# EAGLE design second_flight_computer (EAGLE 9.6.2)
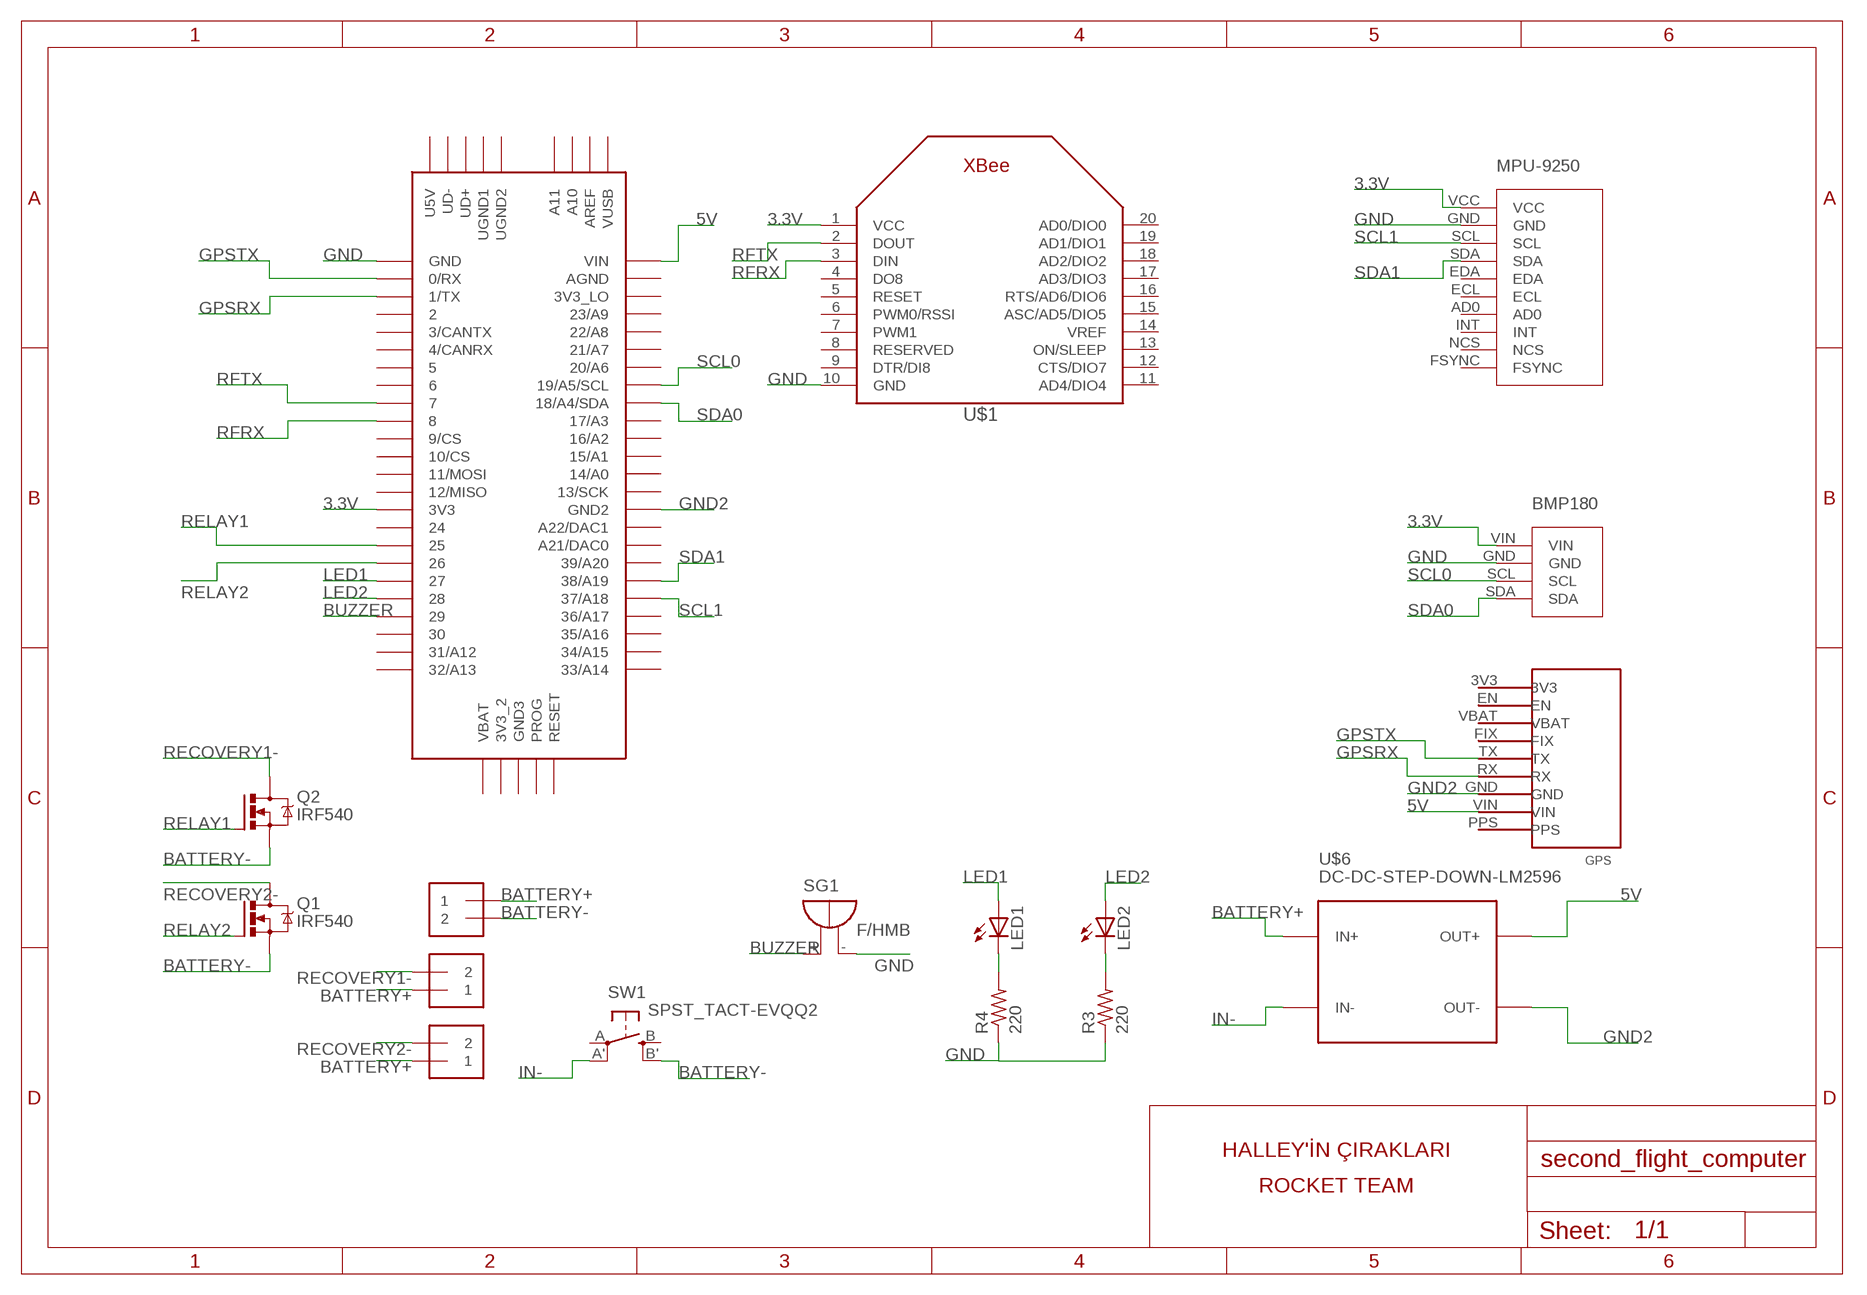
[diagram p0: schematic, sheet 1]

## Parts
BMP1  BMP180  [BMP180]
J1  1X2-3.5MM  [1X2-3.5MM]
J2  1X2-3.5MM  [1X2-3.5MM]
J3  1X2-3.5MM  [1X2-3.5MM]
LED1  LED5MM  [LED5MM]
LED2  LED5MM  [LED5MM]
MPU-1  MPU-9250  [MPU-9250]
Q1  IRF540  NMOSFET_IRF540-TO220  [TO220BV]
Q2  IRF540  NMOSFET_IRF540-TO220  [TO220BV]
R3  220  R-US_0204/7  [0204/7]
R4  220  R-US_0204/7  [0204/7]
SG1  F/HMB  [F/HMB]
SW1  SPST_TACT-EVQQ2  [EVQ-Q2]
U$1  XBEE  [XBEE]
U$3  TEENSY_3.5/3.6  [TEENSY_3.5/3.6]
U$5  GPS  [GPS]
U$6  DC-DC-STEP-DOWN-LM2596  [DC-DC-STEP-DOWN-LM2596]

## Nets
3.3V: BMP1.VIN MPU-1.VCC U$1.1(VCC) U$3.3V3
5V: U$3.VIN U$5.VIN U$6.OUT+
BATTERY+: J1.1 J2.1 J3.1 U$6.IN+
BATTERY-: J1.2 Q1.S Q2.S SW1.B'(S1)
BUZZER: SG1.+ U$3.29
GND: BMP1.GND MPU-1.GND R3.1 R4.1 SG1.- U$1.10(GND) U$3.GND
GND2: U$3.GND2 U$5.GND U$6.OUT-
GPSRX: U$3.1/TX U$5.RX
GPSTX: U$3.0/RX U$5.TX
IN-: SW1.A'(P1) U$6.IN-
LED1: LED1.A U$3.27
LED2: LED2.A U$3.28
N$1: LED1.K(C) R4.2
N$2: LED2.K(C) R3.2
RECOVERY1-: J2.2 Q2.D
RECOVERY2-: J3.2 Q1.D
RELAY1: Q2.G U$3.25
RELAY2: Q1.G U$3.26
RFRX: U$1.3(DIN) U$3.8
RFTX: U$1.2(DOUT) U$3.7
SCL0: BMP1.SCL U$3.19/A5/SCL
SCL1: MPU-1.SCL U$3.37/A18
SDA0: BMP1.SDA U$3.18/A4/SDA
SDA1: MPU-1.SDA U$3.38/A19
Unconnected: MPU-1.AD0 MPU-1.ECL MPU-1.EDA MPU-1.FSYNC MPU-1.INT MPU-1.NCS SW1.A(P) SW1.B(S) U$1.4(DO8) U$1.5(RESET) U$1.6(PWM0/RSSI) U$1.7(PWM1) U$1.8(RESERVED) U$1.9(DTR/DI8) U$1.11(AD4/DIO4) U$1.12(CTS/DIO7) U$1.13(ON/SLEEP) U$1.14(VREF) U$1.15(ASC/AD5/DIO5) U$1.16(RTS/AD6/DIO6) U$1.17(AD3/DIO3) U$1.18(AD2/DIO2) U$1.19(AD1/DIO1) U$1.20(AD0/DIO0) U$3.2 U$3.3/CANTX U$3.3V3_2 U$3.3V3_LO U$3.4/CANRX U$3.5 U$3.6 U$3.9/CS U$3.10/CS U$3.11/MOSI U$3.12/MISO U$3.13/SCK U$3.14/A0 U$3.15/A1 U$3.16/A2 U$3.17/A3 U$3.20/A6 U$3.21/A7 U$3.21/DAC0(A21/DAC0) U$3.22/A8 U$3.23/A9 U$3.24 U$3.30 U$3.31/A12 U$3.32/A13 U$3.33/A14 U$3.34/A15 U$3.35/A16 U$3.36/A17 U$3.39/A20 U$3.A10 U$3.A11 U$3.A22/DAC1 U$3.AGND U$3.AREF U$3.GND3 U$3.PROG U$3.RESET U$3.U5V U$3.UD+ U$3.UD- U$3.UGND1 U$3.UGND2 U$3.VBAT U$3.VUSB U$5.3V3 U$5.EN U$5.FIX U$5.PPS U$5.VBAT

## Notes on the sheet
- HALLEY'İN ÇIRAKLARI
- ROCKET TEAM

## Library data of the parts
BMP1 = BMP180-Lib:BMP180
J1-J3 = adafruit:1X2: 3.5mm Terminal block http://www.ladyada.net/library/pcb/eaglelibrary.html
LED1 LED2 = adafruit:LED: LED OSRAM: - CHIPLED LG R971, LG N971, LY N971, LG Q971, LY Q971, LO R971, LY R971 LH N974, LH R974 LS Q976, LO Q976, LY Q976 LO Q996 - Hyper CHIPLED LW Q18S LB Q993, LB Q99A, LB R99A - SideLED LS A670, LO A670, LY A670, LG A670, LP A670 LB A673, LV A673, LT A673, LW A673 LH A674 LY A675 LS A676, LA A676, LO A676, LY A676, LW A676 LS A679, LY A679, LG A679 - Hyper Micro SIDELED® LS Y876, LA Y876, LO Y876, LY Y876 LT Y87S - SmartLED LW L88C, LW L88S LB L89C, LB L89S, LG L890 LS L89K, LO L89K, LY L89K LS L896, LA L896, LO L896, LY L896 - TOPLED LS T670, LO T670, LY T670, LG T670, LP T670 LSG T670, LSP T670, LSY T670, LOP T670, LYG T670 LG T671, LOG T671, LSG T671 LB T673, LV T673, LT T673, LW T673 LH T674 LS T676, LA T676, LO T676, LY T676, LB T676, LH T676, LSB T676, LW T676 LB T67C, LV T67C, LT T67C, LS T67K, LO T67K, LY T67K, LW E67C LS E67B, LA E67B, LO E67B, LY E67B, LB E67C, LV E67C, LT E67C LW T67C LS T679, LY T679, LG T679 LS T770, LO T770, LY T770, LG T770, LP T770 LB T773, LV T773, LT T773, LW T773 LH T774 LS E675, LA E675, LY E675, LS T675 LS T776, LA T776, LO T776, LY T776, LB T776 LHGB T686 LT T68C, LB T68C - Hyper Mini TOPLED® LB M676 - Mini TOPLED Santana® LG M470 LS M47K, LO M47K, LY M47K Source: http://www.osram.convergy.de/
MPU-1 = MPU-9250:MPU-9250
Q1 Q2 = Transistor:NMOSFET_: N-Channel MOSFET - Popular parts; CATEGORY: Transistor; DESCRIPTION: MOSFET N-CH 100V 33A TO-220AB; DRAIN_CURRENT: 33A; MANUFACTURER: Infineon Technologies; MPN: IRF540NPBF; OPERATING_TEMP: -55°C ~ 175°C; PART_STATUS: Active; ROHS_COMPLIANT: Yes; SUB-CATEGORY: MOSFET; THERMALLOSS: 130W; TYPE: N-Channel
R3 R4 = adafruit:R-US_: RESISTOR, American symbol
SG1 = buzzer:F/HMB: BUZZER Source: Buerklin; OC_FARNELL: unknown; OC_NEWARK: unknown
SW1 = adafruit:SPST_TACT: SMT 6mm switch, EVQQ2 series http://www.ladyada.net/library/eagle
U$1 = adafruit:XBEE
U$3 = Teensy356:TEENSY_3.5/3.6
U$5 = Adafruit Ultimate GPS Breakout:GPS
U$6 = diy-modules:DC-DC-STEP-DOWN-LM2596: DC/DC Step-Down Regulator based on LM2596-ADJ chip LM2596 datasheet available here: http://www.ti.com/lit/ds/symlink/lm2596.pdf Click here to find device on ebay.com <http://www.ebay.com/sch/lm2596+power+regulator>

## Board
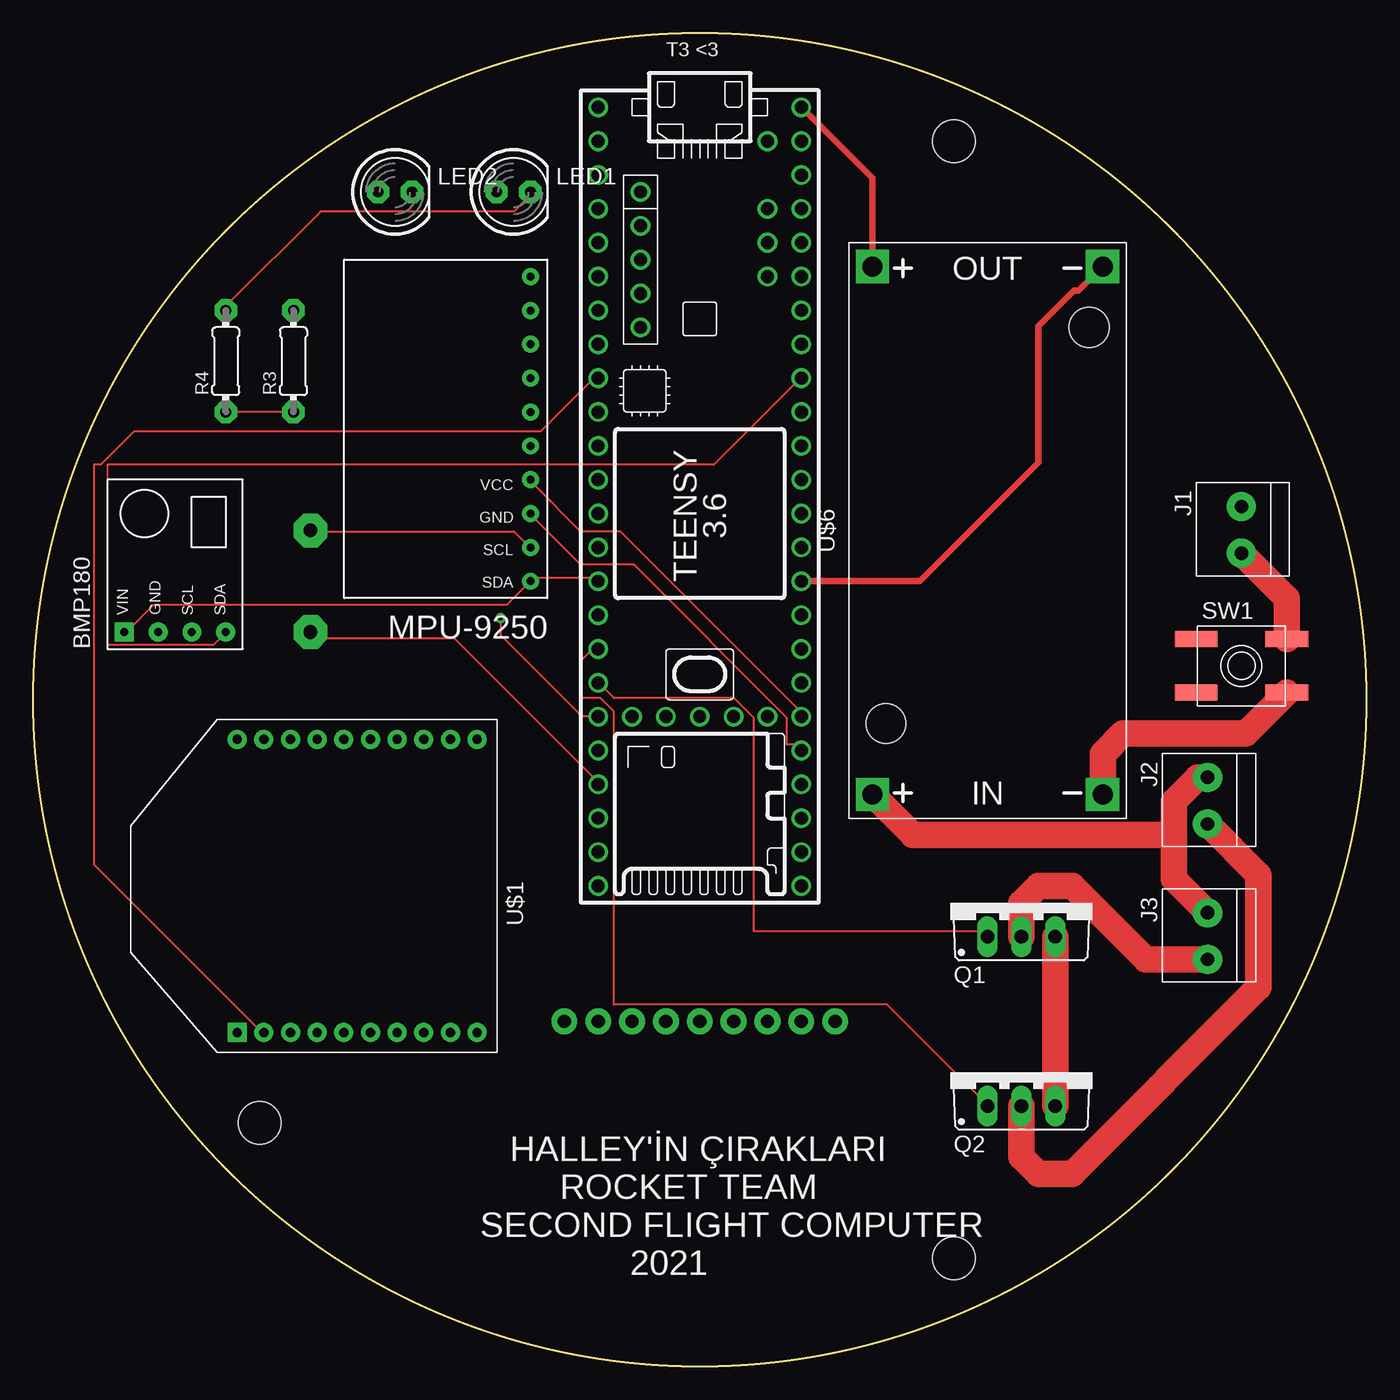
[diagram p1: board, top side]
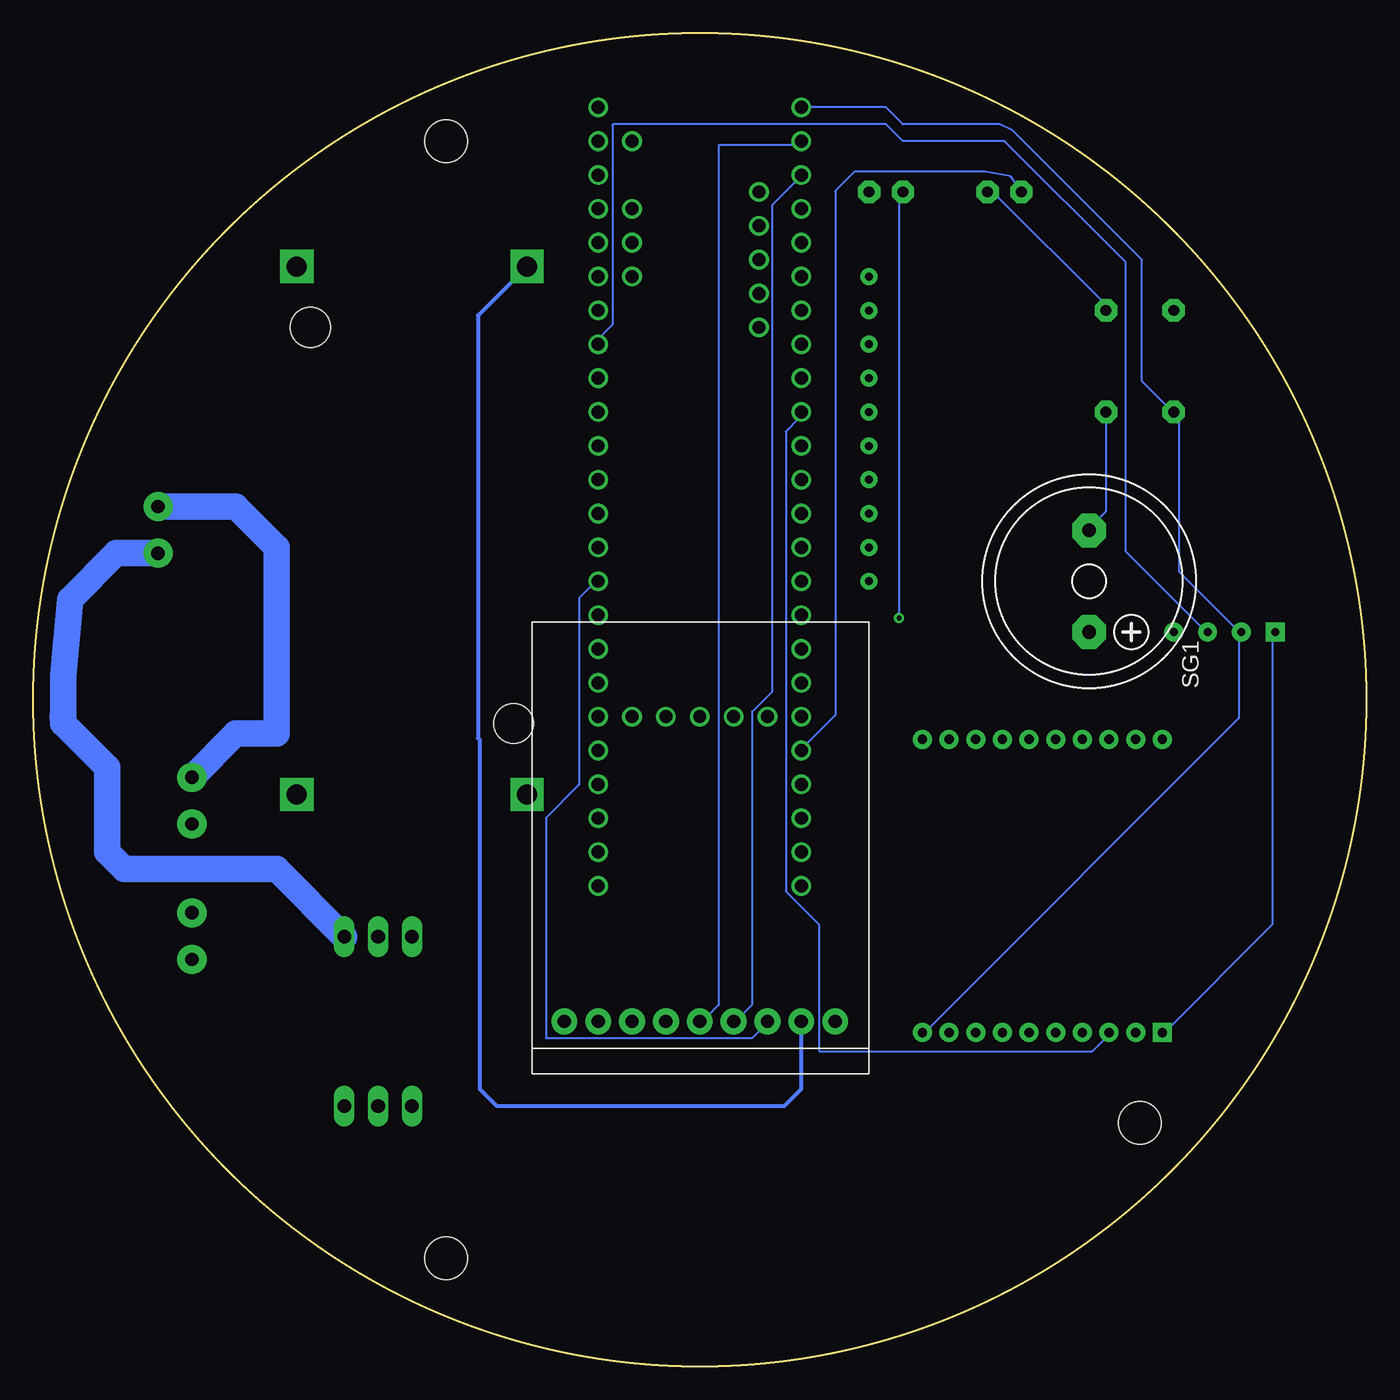
[diagram p2: board, bottom side, seen from below]

Size 100 x 100 mm. Coordinates in mm from the lower left corner, seen from the top.
Outline: circle at 50,50 radius 50
Copper layers (1*16): Top 0.035mm / dielectric 1.5mm / Bottom 0.035mm
Design rules "default": minimum track width 6mil, minimum drill 0.35mm, track to track 6mil, track to pad 6mil, pad to pad 6mil, via to via 6mil, smd to smd 6mil, copper to edge 40mil, drill to drill 6mil, minimum pad ring 10mil, minimum via ring 8mil, stop-mask expansion 4mil, vias tented up to drill 0mil, thermal gap 10mil
Holes 3.2 mm at 69.05,91.91 69.05,8.09 16.98,18.25

### Footprints (pad centres in the part's own frame; a part is rotated, then mirrored left to right if it is on the bottom)
BMP180 = drill 0.6 pad 1.422: GND 0,0; SCL 0,-2.54; SDA 0,-5.08 | drill 0.6 pad 1.422 square: VIN 0,2.54
1X2-3.5MM = drill 1 pad 2.184: 1 1.8,0; 2 -1.7,0
LED5MM = drill 0.813 pad 1.676 octagon: A -1.27,0; K 1.27,0
MPU-9250 = drill 0.6 pad 1.27: AD0 1.27,-16.51; ECL 1.27,-13.97; EDA 1.27,-11.43; FSYNC 1.27,-24.13; GND 1.27,-3.81; INT 1.27,-19.05; NCS 1.27,-21.59; SCL 1.27,-6.35; SDA 1.27,-8.89; VCC 1.27,-1.27
TO220BV = drill 1.016 long: D 0,-2.54; G -2.54,-2.54; S 2.54,-2.54
0204/7 = drill 0.813 pad 1.676 octagon: 1 -3.81,0; 2 3.81,0
F/HMB = drill 1.016 pad 2.54 octagon: + 3.81,0; - -3.81,0
EVQ-Q2 = smd 3.2 x 1.2: A -3.4,-2; A' 3.4,-2; B -3.4,2; B' 3.4,2
XBEE = drill 0.7 pad 1.422 square: 1 -11,5.5 | drill 0.7 pad 1.422: 2 -11,3.5; 3 -11,1.5; 4 -11,-0.5; 5 -11,-2.5; 6 -11,-4.5; 7 -11,-6.5; 8 -11,-8.5; 9 -11,-10.5; 10 -11,-12.5; 11 11,-12.5; 12 11,-10.5; 13 11,-8.5; 14 11,-6.5; 15 11,-4.5; 16 11,-2.5; 17 11,-0.5; 18 11,1.5; 19 11,3.5; 20 11,5.5
TEENSY_3.5/3.6 = drill 0.965: 0/RX -25.4,-7.62; 1/TX -22.86,-7.62; 2 -20.32,-7.62; 3/CANTX -17.78,-7.62; 3V3 7.62,-7.62; 3V3_2 17.78,-2.54; 3V3_LO -22.86,7.62; 4/CANRX -15.24,-7.62; 5 -12.7,-7.62; 6 -10.16,-7.62; 7 -7.62,-7.62; 8 -5.08,-7.62; 9/CS -2.54,-7.62; 10/CS 0,-7.62; 11/MOSI 2.54,-7.62; 12/MISO 5.08,-7.62; 13/SCK 5.08,7.62; 14/A0 2.54,7.62; 15/A1 0,7.62; 16/A2 -2.54,7.62; 17/A3 -5.08,7.62; 18/A4/SDA -7.62,7.62; 19/A5/SCL -10.16,7.62; 20/A6 -12.7,7.62; 21/A7 -15.24,7.62; 21/DAC0 12.7,7.62; 22/A8 -17.78,7.62; 23/A9 -20.32,7.62; 24 10.16,-7.62; 25 12.7,-7.62; 26 15.24,-7.62; 27 17.78,-7.62; 28 20.32,-7.62; 29 22.86,-7.62; 30 25.4,-7.62; 31/A12 27.94,-7.62; 32/A13 30.48,-7.62; 33/A14 30.48,7.62; 34/A15 27.94,7.62; 35/A16 25.4,7.62; 36/A17 22.86,7.62; 37/A18 20.32,7.62; 38/A19 17.78,7.62; 39/A20 15.24,7.62; A10 -17.78,5.08; A11 -15.24,5.08; A22/DAC1 10.16,7.62; AGND -25.4,7.62; AREF -20.32,5.08; GND -27.94,-7.62; GND2 7.62,7.62; GND3 17.78,0; PROG 17.78,2.54; RESET 17.78,5.08; U5V -21.59,-4.445; UD+ -16.51,-4.445; UD- -19.05,-4.445; UGND1 -13.97,-4.445; UGND2 -11.43,-4.445; VBAT 17.78,-5.08; VIN -27.94,7.62; VUSB -25.4,5.08
GPS = drill 1 pad 1.93: 3V3 -12.7,12.7; EN -12.7,10.16; FIX -12.7,5.08; GND -12.7,-2.54; PPS -12.7,-7.62; RX -12.7,0; TX -12.7,2.54; VBAT -12.7,7.62; VIN -12.7,-5.08
DC-DC-STEP-DOWN-LM2596 = drill 1.5 pad 2.5 square: IN+ -19.812,8.636; IN- -19.812,-8.636; OUT+ 19.812,8.636; OUT- 19.812,-8.636 | hole 3: -14.478,7.62; 15.24,-7.62

### Placement (x,y rotation side)
BMP1  9.36,55.08 90 top
J1  90.64,62.7 90 top
J2  88.1,42.38 90 top
J3  88.1,32.22 90 top
LED1  36.03,88.1 0 top
LED2  27.14,88.1 0 top
MPU-1  38.57,57.62 180 top
Q1  74.13,34.76 0 top
Q2  74.13,22.06 0 top
R3  19.52,75.4 90 top
R4  14.44,75.4 90 top
SG1  20.79,58.89 270 bottom
SW1  90.64,52.54 0 top
U$1  20.79,36.03 90 top
U$3  50,66.51 270 top
U$5  47.46,38.57 90 bottom
U$6  71.59,62.7 90 top

### Tracks (layer width: path | path; a pad name or v marks a point on that pad's centre or on a via)
3.3V
  Top 0.152: U$3.3V3 42.05,59.13 37.55,59.13 MPU-1.VCC 37.05,58.63 35.55,57.13 9.05,57.13 7.05,55.13 BMP1.VIN
  Bottom 0.152: U$1.1 15.05,25.13 7.05,33.13 7.05,54.63 BMP1.VIN
5V
  Top 0.5: U$6.OUT+ 62.95,89.12 U$3.VIN
  Bottom 0.305: U$5.VIN 42.38,20.79 43.65,19.52 65.24,19.52 66.51,20.79 66.51,46.99 66.64,47.12 66.64,78.83 U$6.OUT+
BATTERY+
  Top 2: J3.1 85.56,36.56 85.56,39.84 | J2.1 87.36,44.18 85.56,42.38 85.56,39.84 | U$6.IN+ 66,39.84 85.56,39.84
  Bottom 2: J2.1 84.82,47.46 81.75,47.46 81.75,61.43 84.82,64.5 J1.1
BATTERY-
  Top 2: Q2.S Q1.S | SW1.B' 94.04,57.6 J1.2
  Bottom 2: Q1.S 81.75,37.3 93.18,37.3 94.45,38.57 94.45,44.92 97.75,48.22 | 97.8,48.77 97.75,48.22 | 97.75,48.22 97.75,51.78 97.25,57.53 93.78,61 J1.2
BUZZER
  Top 0.152: U$3.29 42.05,44.13 31.55,54.63 21.05,54.63 SG1.+
GND
  Top 0.152: MPU-1.GND 37.05,61.63 36.05,62.63 21.05,62.63 SG1.- | R3.1 19.05,71.63 14.55,71.63 R4.1
  Bottom 0.152: U$1.10 33.05,25.13 9.55,48.63 9.55,54.63 BMP1.GND 9.55,55.13 14.05,59.63 14.05,71.13 R4.1 14.55,71.63 16.82,73.9 16.82,83.02 26.53,92.73 27.49,93.18 34.76,93.18 36.03,94.45 U$3.GND 42.05,94.13 | SG1.- 20.55,63.13 19.55,64.13 19.55,71.13 R3.1
GND2
  Top 0.5: U$6.OUT- 78.42,80.71 78.06,80.71 75.4,78.04 75.4,67.78 66.51,58.89 U$3.GND2
  Bottom 0.152: U$5.GND 45.05,25.63 46.05,24.63 61.55,24.63 61.55,41.13 59.05,43.63 59.05,57.63 58.05,58.63 U$3.GND2
GPSRX
  Bottom 0.152: U$3.1/TX 42.55,89.13 44.55,87.13 44.55,50.63 46.05,49.13 46.05,27.13 47.05,26.13 U$5.RX
GPSTX
  Bottom 0.152: U$3.0/RX 42.55,91.63 48.55,91.63 48.55,27.13 49.55,26.13 U$5.TX
IN-
  Top 2: SW1.A' 90.96,47.46 81.75,47.46 80.23,45.94 U$6.IN-
LED1  (via drill 0.35)
  Top 0.152: v35.05,56.13 35.05,54.86 41.18,48.73 U$3.27
  Bottom 0.152: v35.05,56.13 35.05,87.63 LED1.A
LED2
  Bottom 0.152: U$3.28 42.05,46.63 39.82,48.86 39.82,88.19 38.38,89.63 28.59,89.63 26.7,89.27 LED2.A
N$1
  Top 0.152: R4.2 14.55,79.63 21.55,86.63 36.05,86.63 37.05,87.63 LED1.K
N$2
  Bottom 0.152: R3.2 19.55,79.63 28.05,88.13 LED2.K
RECOVERY1-
  Top 2: Q2.D 74.13,15.71 75.4,14.44 77.94,14.44 91.91,28.41 91.91,36.87 J2.2
RECOVERY2-
  Top 2: Q1.D 74.13,34.76 75.4,36.03 77.94,36.03 83.45,30.52 J3.2
RELAY1
  Top 0.152: U$3.25 41.96,53.81 41.05,52.9 41.05,50.13 42.55,50.13 43.55,49.13 43.55,27.13 64.05,27.13 71.55,19.63 Q2.G
RELAY2
  Top 0.152: U$3.26 42.55,51.13 43.55,50.13 52.55,50.13 54.05,48.63 54.05,32.63 71.55,32.63 Q1.G
RFRX
  Bottom 0.152: U$1.3 19.55,24.63 20.55,23.63 41.05,23.63 41.05,33.13 43.55,35.63 43.55,70.13 42.55,71.13 U$3.8
RFTX
  Top 0.152: U$1.2 17.05,25.13 4.55,37.63 4.55,67.63 5.05,67.63 7.55,70.13 38.05,70.13 42.05,74.13 U$3.7
SCL0
  Bottom 0.152: BMP1.SCL 12.05,55.13 18.05,61.13 18.05,82.82 27.14,91.91 34.76,91.91 36.03,93.18 56.5,93.18 56.55,93.13 56.55,78.13 57.55,77.13 U$3.19/A5/SCL
SCL1
  Top 0.152: MPU-1.SCL 37.55,63.63 41.05,60.13 45.05,60.13 56.55,48.63 56.55,46.63 57.55,46.63 U$3.37/A18
SDA0
  Top 0.152: BMP1.SDA 14.05,54.63 13.55,54.13 5.55,54.13 5.55,67.63 51.05,67.63 57.55,74.13 U$3.18/A4/SDA
SDA1
  Top 0.152: MPU-1.SDA 37.55,66.13 41.05,62.63 44.05,62.63 57.55,49.13 U$3.38/A19

### Text on the board
tNames: T3 <3 | HALLEY'İN ÇIRAKLARI / ROCKET TEAM / SECOND FLIGHT COMPUTER / 2021